# Altium schematic sheet mainboard.SchDoc
size 330 x 330 mm; SheetNumber: 1; SheetTotal: 1
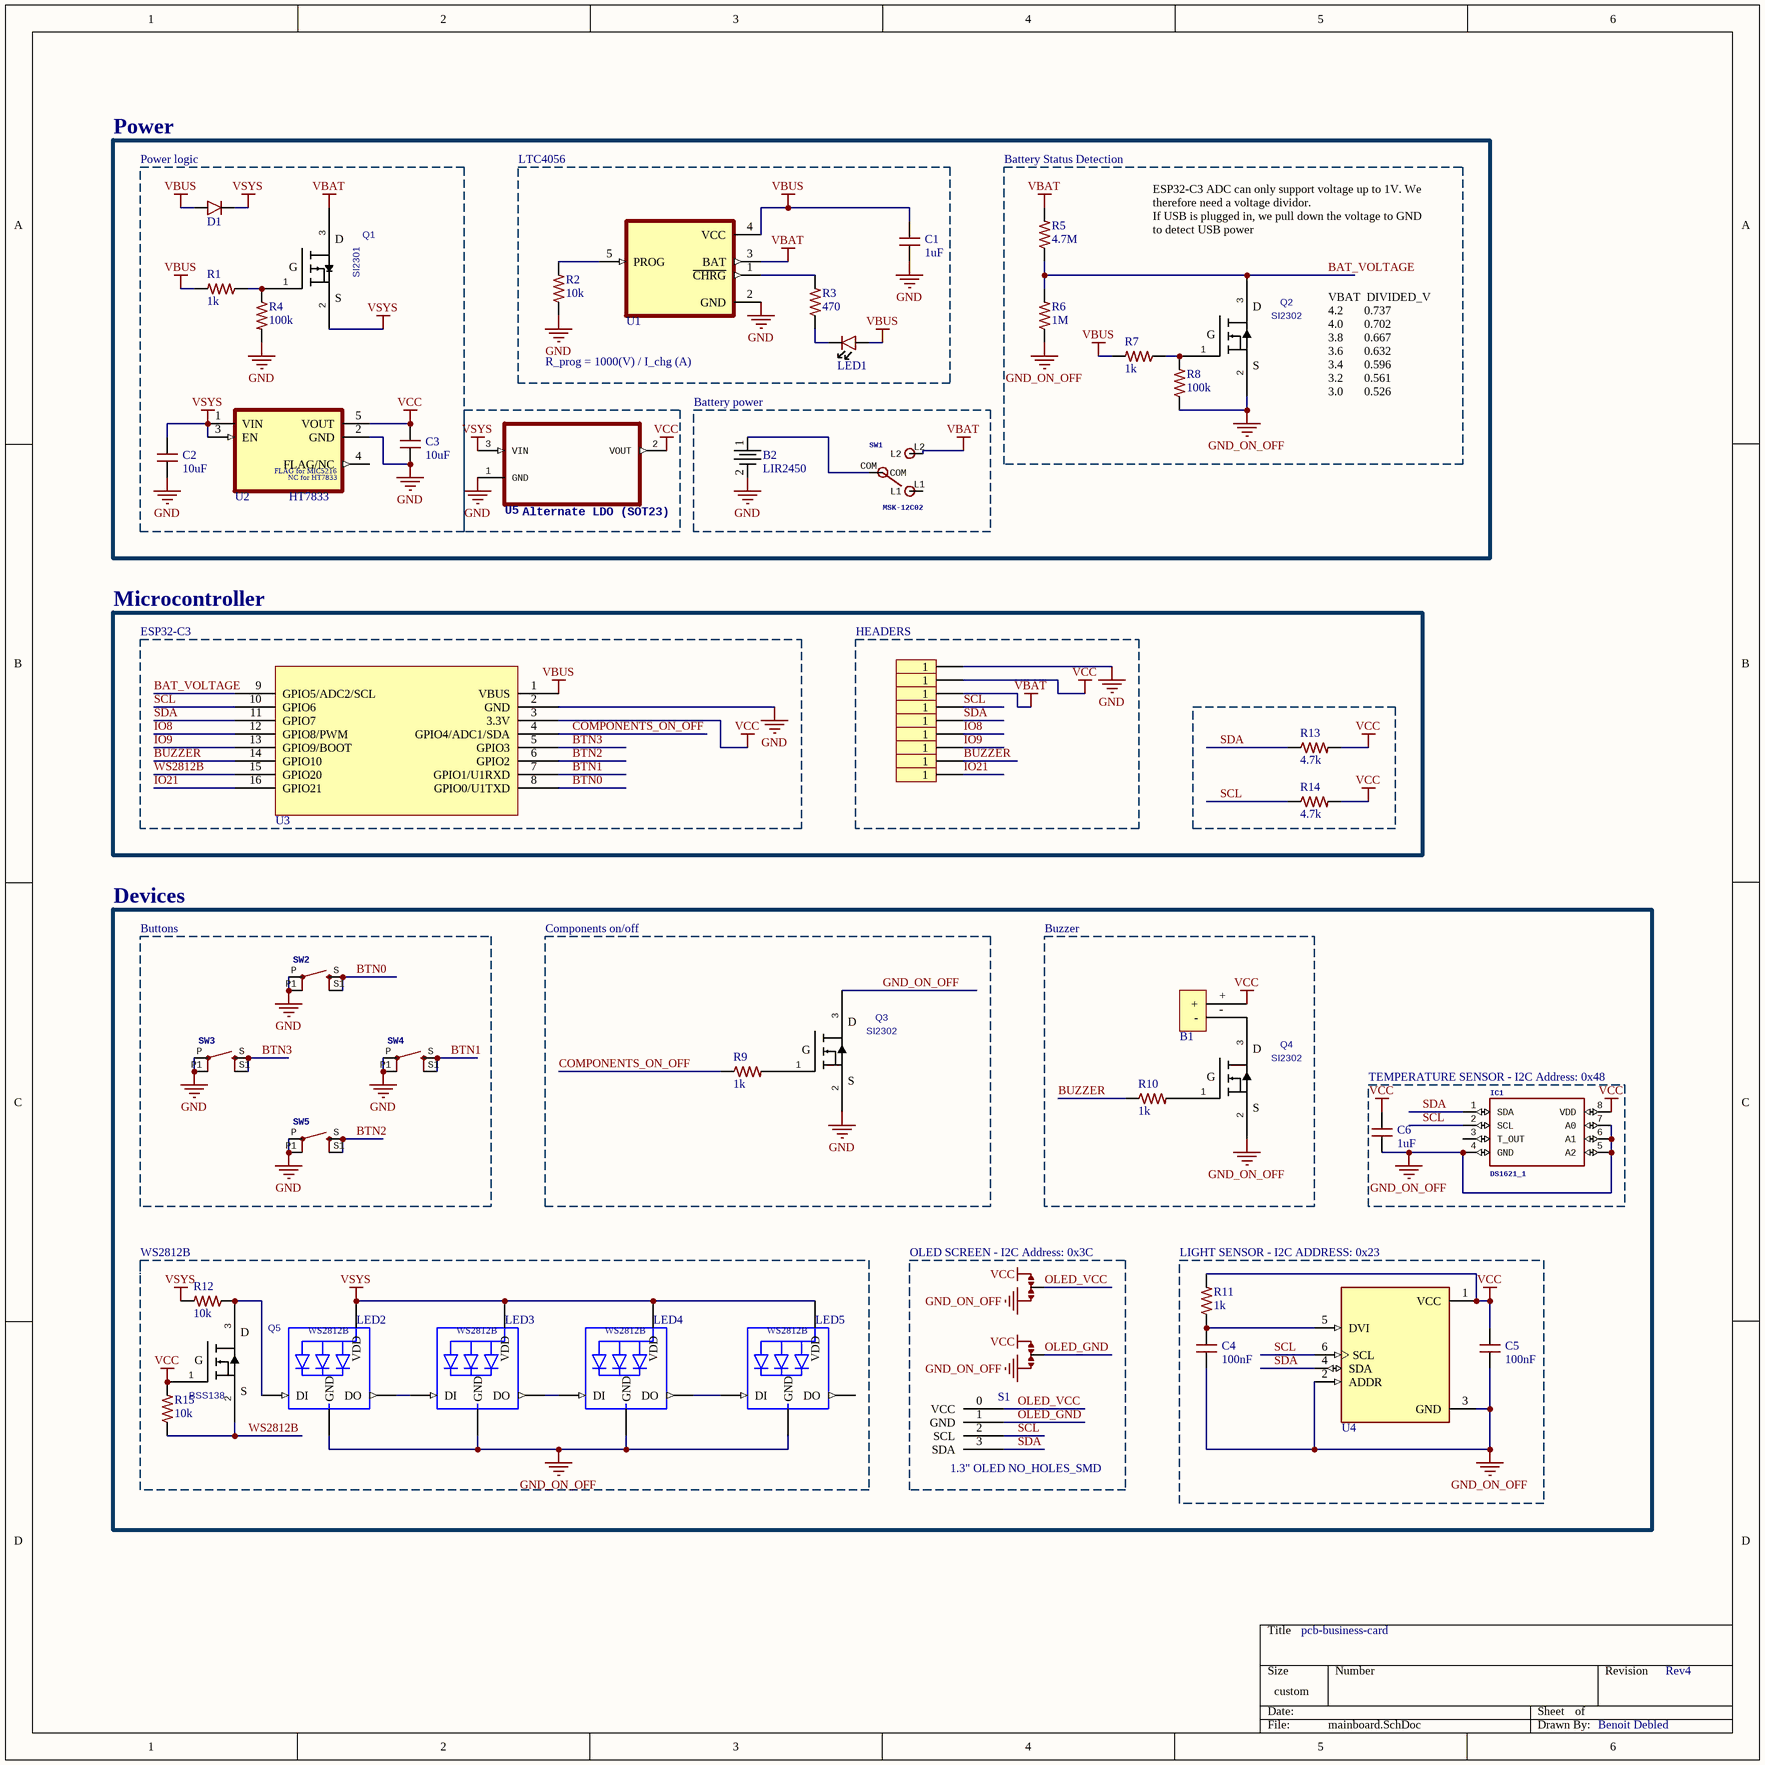
[diagram p0: mainboard.SchDoc]

## Parts
*  PAD 1  [PAD_50mil_x_80mil]  (value not drawn)
*1  PAD 1  [PAD_50mil_x_80mil]  (value not drawn)
*2  PAD 1  [PAD_50mil_x_80mil]  (value not drawn)
*3  PAD 1  [PAD_50mil_x_80mil]  (value not drawn)
*4  PAD 1  [PAD_50mil_x_80mil]  (value not drawn)
*5  PAD 1  [PAD_50mil_x_80mil]  (value not drawn)
*6  PAD 1  [PAD_50mil_x_80mil]  (value not drawn)
*7  PAD 1  [PAD_50mil_x_80mil]  (value not drawn)
*8  PAD 1  [PAD_50mil_x_80mil]  (value not drawn)
B1  Buzzer5x5x2  [BUZZER_5x5x2]  (value not drawn)
B2  LIR2450  [LIR2450]
C1  1uF  [C0805K]
C2  10uF  [C0805K]
C3  10uF  [C0805K]
C4  100nF  [C0805K]
C5  100nF  [C0805K]
C6  1uF  [C0805K]
D1  Diode_M7  [DO-214]  (value not drawn)
IC1  DS1621_1  [SOP-8]
JMP1  0R-JUMPA  [A0R-JMP]  (value not drawn)  (part A of 2)
JMP2  0R-JUMPA  [A0R-JMP]  (value not drawn)  (part A of 2)
LED1  LED  [LED0805K]  (value not drawn)
LED2  WS2812B  [WS2812B]  (value not drawn)
LED3  WS2812B  [WS2812B]  (value not drawn)
LED4  WS2812B  [WS2812B]  (value not drawn)
LED5  WS2812B  [WS2812B]  (value not drawn)
Q1  SI2301  [SOT-23]
Q2  SI2302  [SOT-23]
Q3  SI2302  [SOT-23]
Q4  SI2302  [SOT-23]
Q5  BSS138  [SOT-23]
R1  1k  [R0805W]
R2  10k  [R0805W]
R3  470  [R0805W]
R4  100k  [R0805W]
R5  4.7M  [R0805W]
R6  1M  [R0805W]
R7  1k  [R0805W]
R8  100k  [R0805W]
R9  1k  [R0805W]
R10  1k  [R0805W]
R11  1k  [R0805W]
R12  10k  [R0805W]
R13  4.7k  [R0805K]
R14  4.7k  [R0805K]
R15  10k  [R0805W]
S1  1.3" OLED NO_HOLES_SMD  [1.3_NO-holes_SMD]
SW1  MSK-12C02  [MSK-12C02]
SW2  10-XX-6MD  [BT6X6]  (value not drawn)
SW3  10-XX-6MD  [BT6X6]  (value not drawn)
SW4  10-XX-6MD  [BT6X6]  (value not drawn)
SW5  10-XX-6MD  [BT6X6]  (value not drawn)
U1  LTC4054  [SOT23-5]  (value not drawn)
U2  HT7833  [SOT23-5]
U3  ESP32C3  [ESP32-C3-module]  (value not drawn)
U4  BH1750  [XDCR_BH1750FVI-TR]  (value not drawn)
U5  Alternate LDO (SOT23)  [SOT95P237X112-3N]

## Blocks framed on the sheet
Power: C1 LED1 R2 R3 U1 U5
Power logic: C2 C3 D1 Q1 R1 R4 U2
Battery Status Detection: Q2 R5-R8
Battery power: B2 SW1
Microcontroller: R13 R14
ESP32-C3: U3
HEADERS: * *1-*8
Devices: LED2-LED5 Q5 R12 R15
Buttons: SW2-SW5
Components on/off: Q3 R9
Buzzer: B1 Q4 R10
TEMPERATURE SENSOR - I2C Address: 0x48: C6 IC1
OLED SCREEN - I2C Address: 0x3C: JMP1 JMP2 S1
LIGHT SENSOR - I2C ADDRESS: 0x23: C4 C5 R11 U4

## Nets
GND: *.1 B2.2(-) C1.2 C2.2 C3.2 Q3.2(S) R2.1 R4.2 SW2.P SW2.P1 SW3.P SW3.P1 SW4.P SW4.P1 SW5.P SW5.P1 U1.2(GND) U2.2(GND) U3.2(GND) U5.1(GND)
GND_ON_OFF: C4.2 C5.2 C6.2 IC1.4(GND) IC1.5(A2) IC1.6(A1) IC1.7(A0) JMP1.3 JMP2.3 LED2.3-GND(GND) LED3.3-GND(GND) LED4.3-GND(GND) LED5.3-GND(GND) Q2.2(S) Q3.3(D) Q4.2(S) R6.1 R8.1 U4.2(ADDR) U4.3(GND)
VBAT: *2.1 Q1.3(D) R5.2 SW1.L2 U1.3(BAT)
VBUS: C1.1 D1.A LED1.1 R1.2 R7.2 U1.4(VCC) U3.1(VBUS)
VCC: *1.1 B1.+ C3.1 C5.1 C6.1 IC1.8(VDD) JMP1.1 JMP2.1 Q5.1(G) R11.2 R13.2 R14.2 R15.2 U2.5(VOUT) U3.3(3.3V) U4.1(VCC) U5.2(VOUT)
VSYS: C2.1 D1.C LED2.1-VDD(VDD) LED3.1-VDD(VDD) LED4.1-VDD(VDD) LED5.1-VDD(VDD) Q1.2(S) R12.2 U2.1(VIN) U2.3(EN) U5.3(VIN)
BAT_VOLTAGE: Q2.3(D) R5.1 R6.2 U3.9(GPIO5/ADC2/SCL)
BTN0: SW2.S SW2.S1 U3.8(GPIO0/U1TXD)
BTN1: SW4.S SW4.S1 U3.7(GPIO1/U1RXD)
BTN2: SW5.S SW5.S1 U3.6(GPIO2)
BTN3: SW3.S SW3.S1 U3.5(GPIO3)
BUZZER: *7.1 R10.1 U3.14(GPIO10)
COMPONENTS_ON_OFF: R9.1 U3.4(GPIO4/ADC1/SDA)
IO8: *5.1 U3.12(GPIO8/PWM)
IO9: *6.1 U3.13(GPIO9/BOOT)
IO21: *8.1 U3.16(GPIO21)
OLED_GND: JMP2.2 S1.1(GND)
OLED_VCC: JMP1.2 S1.0(VCC)
SCL: *3.1 IC1.2(SCL) R14.1 S1.2(SCL) U3.10(GPIO6) U4.6(SCL)
SDA: *4.1 IC1.1(SDA) R13.1 S1.3(SDA) U3.11(GPIO7) U4.4(SDA)
WS2812B: Q5.2(S) R15.1 U3.15(GPIO20)
NetB1_-: B1.- Q4.3(D)
NetB2_1: B2.1(+) SW1.COM
NetC4_1: C4.1 R11.1 U4.5(DVI)
NetLED1_2: LED1.2 R3.1
NetLED2_2-DOUT: LED2.2-DOUT(DO) LED3.4-DIN(DI)
NetLED2_4-DIN: LED2.4-DIN(DI) Q5.3(D) R12.1
NetLED3_2-DOUT: LED3.2-DOUT(DO) LED4.4-DIN(DI)
NetLED4_2-DOUT: LED4.2-DOUT(DO) LED5.4-DIN(DI)
NetQ1_1: Q1.1(G) R1.1 R4.1
NetQ2_1: Q2.1(G) R7.1 R8.2
NetQ3_1: Q3.1(G) R9.2
NetQ4_1: Q4.1(G) R10.2
NetR2_2: R2.2 U1.5(PROG)
NetR3_2: R3.2 U1.1(~{CHRG})

Not connected (* = marked no-connect by the designer): IC1 3(T_OUT); LED5 2-DOUT(DO); SW1 L1; U2 4(FLAG/NC)

## Notes on the sheet
- LTC4056
- ESP32-C3 ADC can only support voltage up to 1V. We therefore need a voltage dividor.
  If USB is plugged in, we pull down the voltage to GND to detect USB power
- R_prog = 1000(V) / I_chg (A)
- VBAT  DIVIDED_V
  4.2       0.737
  4.0       0.702
  3.8       0.667
  3.6       0.632
  3.4       0.596
  3.2       0.561
  3.0       0.526
- (near R12) WS2812B
- pcb-business-card
- Rev4
- Benoit Debled
- (in symbol HT7833-MIC5216) FLAG for MIC5216; NC for HT7833

## Library data of the parts
C1-C6 = C-USC0805K
IC1 = DS1621_1: GateName_1: G$1; SymbolName_1: TP4056; LibraryName: bd-component; DeviceSetName: TP4056; Package: SOP-8
JMP1 JMP2 = 0R-JUMPA: GateName_1: -0R; SymbolName_1: 0RJM; GateName_2: G$2; SymbolName_2: JMP; DeviceName: A; LibraryName: bd-misc; DeviceSetName: 0R-JUMP; Package: A0R-JMP
LED2-LED5 = WS2812B: Raspberry Pi HAT _40 pin_ Wheeled Robotics Kit; MF: SparkFun Electronics; Availability: Unavailable; SnapEDA_Link: https://www.snapeda.com/parts/WS2812B/Worldsemi/view-part/1038297/?ref=snap; MP: WS2812B; Price: None; Value: *; Package: None
Q1 = SI2301: Value: IRLZ44NPBF; C: Copyright (C) 2018 Accelerated Designs. All rights reserved; Vendor: Infineon; Built_By: EMA_UL_Team; Manufacturer_Part_Number: IRLZ44NPBF; Copyright: Copyright (C) 2018 Accelerated Designs. All rights reserved
Q2-Q5 = SI2302: Value: IRLZ44NPBF; C: Copyright (C) 2018 Accelerated Designs. All rights reserved; Vendor: Infineon; Built_By: EMA_UL_Team; Manufacturer_Part_Number: IRLZ44NPBF; Copyright: Copyright (C) 2018 Accelerated Designs. All rights reserved
R1-R12 R15 = R-US_R0805W
R13 R14 = R-US_R0805
SW1 = MSK-12C02: SymbolName_1: SPDT_SWITCH; GateName_1: MSK-12C02; LibraryName: bd-switch; DeviceSetName: MSK-12C02; Package: MSK-12C02
SW2-SW5 = 10-XX-6MD: GateName_1: 1; SymbolName_1: TS2; DeviceName: -4.5SMD; DeviceSetName: 10-XX; LibraryName: bd-switch; Package: BT4.5X4.5
U1 = LTC4054: Battery Charger Li-Ion 10mA to 150mA 4.2V 5-Pin TSOT-23 T/R; MP: LTC4054LES5-4.2#TRPBF; MF: Analog Devices; SnapEDA_Link: https://www.snapeda.com/parts/LTC4054LES5-4.2%23TRPBF/Analog%20Devices/view-part/4339236/?ref=snap; Digi-Key_Purchase_URL: https://www.digikey.com/product-detail/en/linear-technology-analog-devices/LTC4054LES5-4.2-TRPBF/LTC4054LES5-4.2-TRPBFCT-ND/1888452?utm_source=snapeda&utm_medium=aggregator&utm_campaign=symbol; Package: SOT-23-5 Analog Devices; Digi-Key_Part_Number: LTC4054LES5-4.2#TRPBFCT-ND; Value: *
U2 = HT7833-MIC5216: LDO Regulator; MP: LTC4054LES5-4.2#TRPBF; MF: Analog Devices; SnapEDA_Link: https://www.snapeda.com/parts/LTC4054LES5-4.2%23TRPBF/Analog%20Devices/view-part/4339236/?ref=snap; Digi-Key_Purchase_URL: https://www.digikey.com/product-detail/en/linear-technology-analog-devices/LTC4054LES5-4.2-TRPBF/LTC4054LES5-4.2-TRPBFCT-ND/1888452?utm_source=snapeda&utm_medium=aggregator&utm_campaign=symbol; Package: SOT-23-5 Analog Devices; Digi-Key_Part_Number: LTC4054LES5-4.2#TRPBFCT-ND; Value: *
U4 = BH1750: Optical Sensor Ambient 560nm IÂ²C 6-SMD, Flat Lead Exposed Pad; MF: Rohm; MP: BH1750FVI-TR; Value: *; SnapEDA_Link: https://www.snapeda.com/parts/BH1750FVI-TR/Rohm/view-part/?ref=snap; Purchase-URL: https://pricing.snapeda.com/search/part/BH1750FVI-TR/?ref=eda; Availability: In Stock; Price: None; Package: SMD-6 ROHM Semiconductor; Check_prices: https://www.snapeda.com/parts/BH1750FVI-TR/Rohm/view-part/?ref=eda
U5 = MCP1700T-3302E/TT: GateName_1: A; SymbolName_1: MCP1700T-3302E/TT; LibraryName: bd-component; DeviceSetName: MCP1700T-3302E/TT; Package: SOT95P237X112-3N; MPN: MCP1700T-3302E/TT; OC_FARNELL: 1296592; OC_NEWARK: 88H9817; PACKAGE: SOT23-3; SUPPLIER: Microchip